# Altium schematic sheet FuenteCapacitiva.SchDoc
size A4
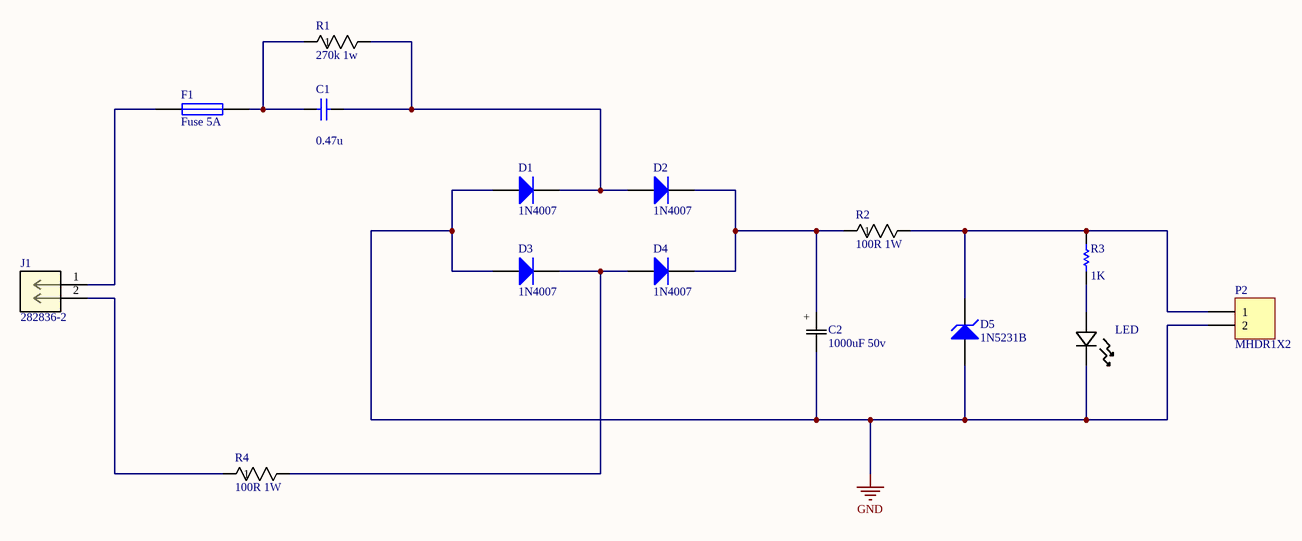
[diagram p0: FuenteCapacitiva.SchDoc]

## Parts
C1  value 0.47u  [Cap470n400v]  (hidden comment: Cap)
C2  1000uF 50v  [CAP_12.5 X 25]
D1  1N4007  [DO-41]
D2  1N4007  [DO-41]
D3  1N4007  [DO-41]
D4  1N4007  [DO-41]
D5  1N5231B  [DO-35]
F1  Fuse 5A  [PIN-W2/E2.8]
J1  282836-2  [CONN2_282836-2]
LED  (no value)  [HLMP]
P2  MHDR1X2  [MHDR1X2]
R1  270k 1w  [PR01]
R2  100R 1W  [YAG_FMP100]
R3  value 1K  [AXIAL-0.3]  (hidden comment: Res1)
R4  100R 1W  [YAG_FMP100]

## Nets
GND: C2.2 D1.1(A) D3.1(A) D5.1(A) LED.1 P2.2
NetC1_1: C1.1 F1.2 R1.1
NetC1_2: C1.2 D1.2(K) D2.1(A) R1.2
NetC2_1: C2.1 D2.2(K) D4.2(K) R2.1
NetD3_2: D3.2(K) D4.1(A) R4.2
NetD5_2: D5.2(K) P2.1 R2.2 R3.1
NetF1_1: F1.1 J1.1
NetJ1_2: J1.2 R4.1
NetLED_2: LED.2 R3.2

## Notes on the sheet
- (near C2) +

## Library data of the parts
C1 = Cap: Capacitor; Published: 8-Jun-2000; LatestRevisionDate: 17-Jul-2002; LatestRevisionNote: Re-released for DXP Platform.; PackageReference: RAD-0.3; Publisher: Altium Limited; PackageDescription: Radial Cap, Thru-Hole; 2 Leads; 0.3 in Pin Spacing
C2 = UVY1H102MHD: Imported; Vendor: NICHICON; Built_By: EMA_UL_Team; Type: DEV; C: Copyright (C) 2015 Accelerated Designs. All rights reserved; Manufacturer_Part_Number: UVY1H102MHD; RefDes: RefDes; Value: Value
D1-D4 = 1N4007: 1.0 Ampere General Purpose Rectifier; Published: 8-Jun-2000; LatestRevisionDate: 17-Jul-2002; LatestRevisionNote: Re-released for DXP Platform.; DatasheetDocument: 1998; PackageDocument: Aug-1999; PackageReference: DO-41; Publisher: Altium Limited; Code_JEDEC: DO-204-AL; ComponentLink1Description: Manufacturer Link; ComponentLink1URL: http://www.fairchildsemi.com/; ComponentLink2Description: Pinout Specification; ComponentLink2URL: http://www.fairchildsemi.com/ds/1N%2F1N4001.pdf
D5 = 1N5231B: Half Watt Zener; Published: 8-Jun-2000; LatestRevisionDate: 17-Jul-2002; LatestRevisionNote: Re-released for DXP Platform.; DatasheetDocument: 1997; PackageReference: DO-35; Publisher: Altium Limited; Code_JEDEC: DO-204-AH; ComponentLink1Description: Manufacturer Link; ComponentLink1URL: http://www.fairchildsemi.com/; ComponentLink2Description: Datasheet; ComponentLink2URL: http://www.fairchildsemi.com/ds/1N%2F1N5226B.pdf
F1 = Fuse 1: Fuse; Published: 8-Jun-2000; LatestRevisionDate: 17-Jul-2002; LatestRevisionNote: Re-released for DXP Platform.; PackageReference: PIN-W2/E2.8; Publisher: Altium Limited; PackageDescription: Thru-Hole; 2 Leads
J1 = 282836-2: TERMI-BLOK PCB MOUNT  90 2P.; Vendor: TE Connectivity; Built_By: EMA_UL_Team; ROWS/CONFIG: 1; PITCH(MM): 5; POSITIONS: 2; C: Copyright (C) 2015 Accelerated Designs. All rights reserved; Manufacturer_Part_Number: 282836-2; Copyright: Copyright (C) 2016 Accelerated Designs. All rights reserved; TE_Part_Number: 282836-2; PRODUCT: Terminal Block Headers & Receptacles; Type: DEV; RefDes: RefDes; Value: Value
LED = HLMP-1301: Imported; Vendor: Avago Technologies; Built_By: EMA_UL_Team; C: Copyright (C) 2015 Accelerated Designs. All rights reserved; Manufacturer_Part_Number: HLMP-1301; RefDes: RefDes; Type: DEV; Value: Value
P2 = MHDR1X2: Header, 2-Pin; LatestRevisionDate: 17-Jul-2002; LatestRevisionNote: Re-released for DXP Platform.; Publisher: Altium Limited
R1 = PR01000104703JR5: Imported; Manufacturer_Part_Number: PR01000104703JR500; Vendor: Vishay; Built_By: EMA_UL_Team; C: Copyright (C) 2015 Accelerated Designs. All rights reserved; RefDes: RefDes; Type: DEV; Value: Value
R2 R4 = FMP100JR-52-100R: Imported; Vendor: Yageo; Built_By: EMA_UL_Team; C: Copyright (C) 2015 Accelerated Designs. All rights reserved; Manufacturer_Part_Number: FMP100JR-52-100R; RefDes: RefDes; Type: DEV; Value: Value
R3 = Res1: Resistor; Published: 8-Jun-2000; LatestRevisionDate: 17-Jul-2002; LatestRevisionNote: Re-released for DXP Platform.; PackageReference: AXIAL-0.3; Publisher: Altium Limited; PackageDescription: Axial Device, Thru-Hole; 2 Leads; 0.3 in Pin Spacing